# EAGLE design raspi (EAGLE 6.4)
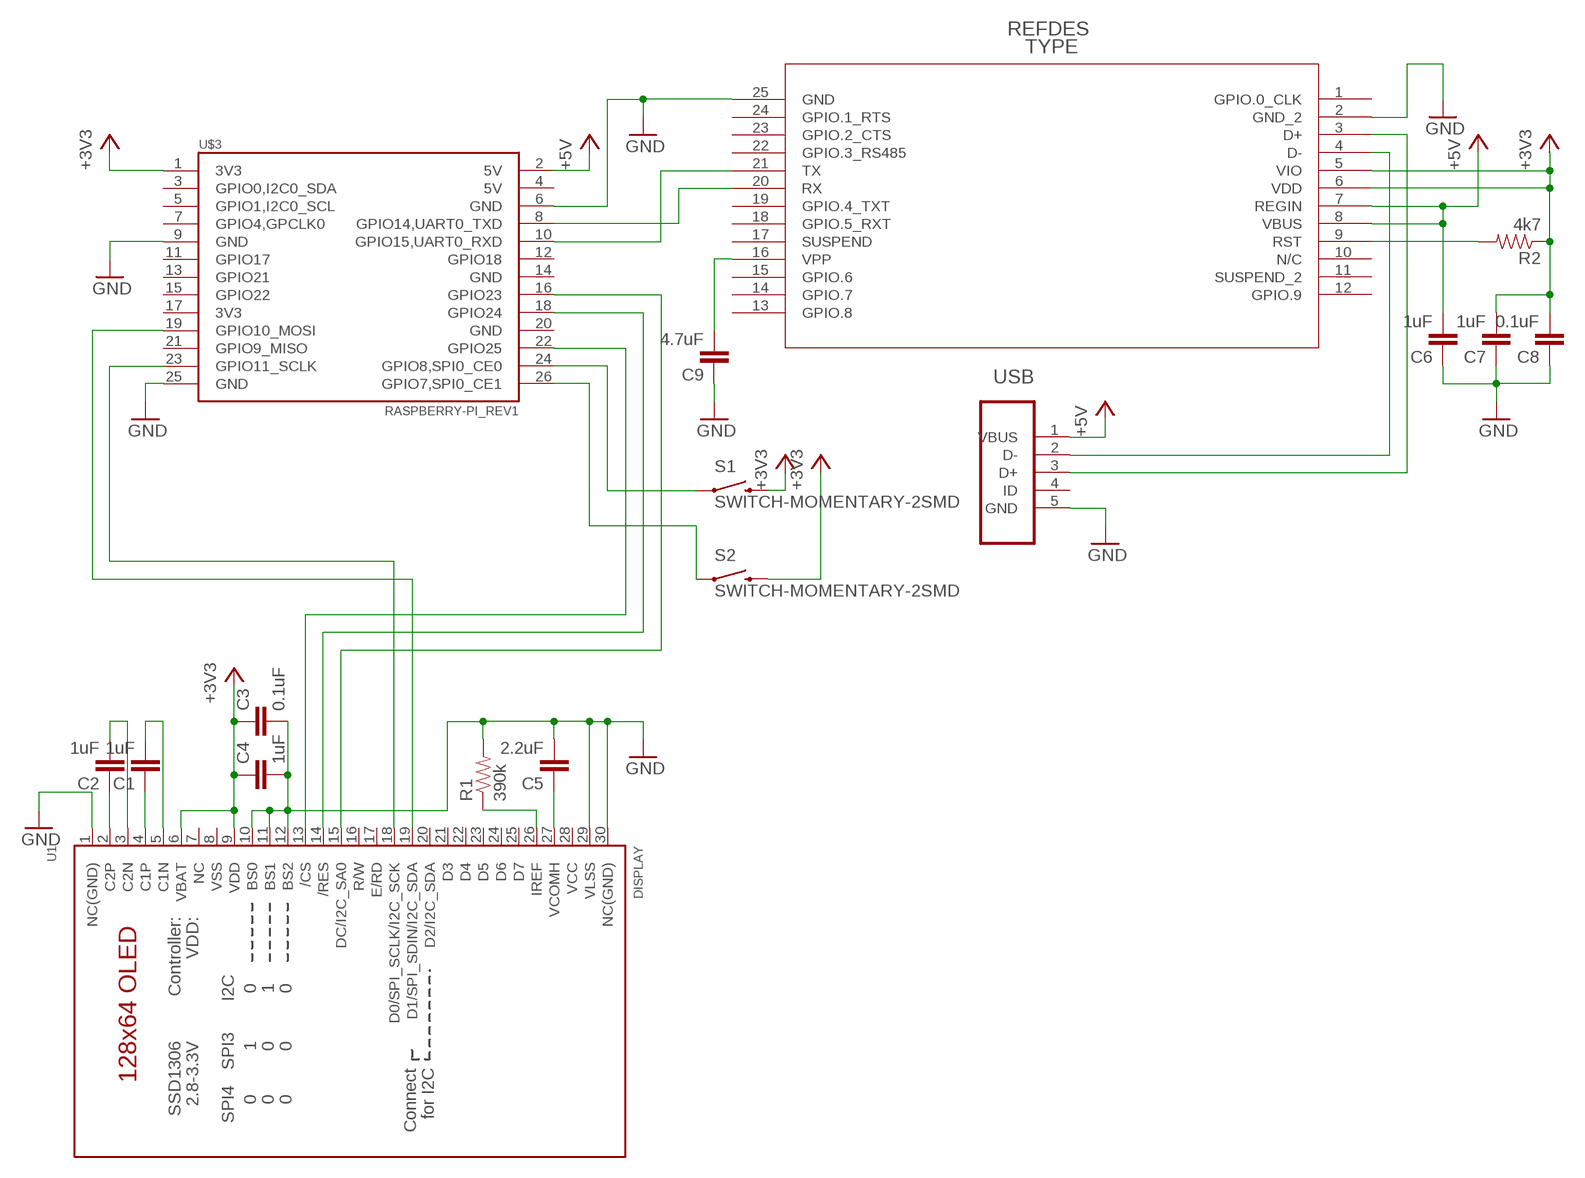
[diagram p0: schematic, sheet 1]

## Parts
C1  1uF  CAP0805  [0805]
C2  1uF  CAP0805  [0805]
C3  0.1uF  CAP0805  [0805]
C4  1uF  CAP0805  [0805]
C5  2.2uF  CAP0805  [0805]
C6  1uF  CAP0805  [0805]
C7  1uF  CAP0805  [0805]
C8  0.1uF  CAP0805  [0805]
C9  4.7uF  CAP0805  [0805]
R1  390k  RESISTOR0805-RES  [0805]
R2  4k7  RESISTOR0805-RES  [0805]
S1  SWITCH-MOMENTARY-2SMD  [TACTILE_SWITCH_SMD]
S2  SWITCH-MOMENTARY-2SMD  [TACTILE_SWITCH_SMD]
U1  DISPLAY  DISP_OLED_UG-2864HSWEG010.96"  [UG-2864HSWEG01_0.96IN_WRAPAROUND]
U2  CP2110-F01-GM  [CP2110-F01-GM]
U$3  RASPBERRY-PI_REV1  [RASPBERRY-PI_REV1]
USB  47346-0001  [MOLEX_47346-0001]

## Nets
+3V3: C3.1 C4.1 C7.2 C8.2 R2.1 S1.3 S2.3 U1.6(VBAT) U1.9(VDD) U2.5(VIO) U2.6(VDD) U$3.1(3V3)
+5V: C6.2 U2.7(REGIN) U2.8(VBUS) U$3.2(5V) USB.1(VBUS)
GND: C3.2 C4.2 C5.2 C6.1 C7.1 C8.1 C9.1 R1.2 U1.1(NC(GND)) U1.10(BS0) U1.11(BS1) U1.12(BS2) U1.29(VLSS) U1.30(NC(GND)) U2.2(GND_2) U2.25(GND) U$3.6(GND) U$3.9(GND) U$3.25(GND) USB.5(GND)
N$1: U1.19(D1/SPI_SDIN/I2C_SDA) U$3.19(GPIO10_MOSI)
N$2: S2.1 U$3.26(GPIO7,SPI0_CE1)
N$3: S1.1 U$3.24(GPIO8,SPI0_CE0)
N$4: U1.15(DC/I2C_SA0) U$3.16(GPIO23)
N$5: U1.18(D0/SPI_SCLK/I2C_SCK) U$3.23(GPIO11_SCLK)
N$6: C5.1 U1.27(VCOMH)
N$7: U1.13(/CS) U$3.22(GPIO25)
N$8: U1.14(/RES) U$3.18(GPIO24)
N$9: R1.1 U1.26(IREF)
N$10: C2.1 U1.2(C2P)
N$11: C1.1 U1.4(C1P)
N$12: C2.2 U1.3(C2N)
N$13: C1.2 U1.5(C1N)
N$14: C9.2 U2.16(VPP)
N$16: U2.21(TX) U$3.10(GPIO15,UART0_RXD)
N$17: U2.20(RX) U$3.8(GPIO14,UART0_TXD)
N$20: R2.2 U2.9(RST)
USB_D_N: U2.4(D-) USB.2(D-)
USB_D_P: U2.3(D+) USB.3(D+)
Unconnected: U1.7(NC) U1.16(R/W) U1.17(E/RD) U1.20(D2/I2C_SDA) U1.21(D3) U1.22(D4) U1.23(D5) U1.24(D6) U1.25(D7) U2.1(GPIO.0_CLK) U2.10(N/C) U2.11(SUSPEND_2) U2.12(GPIO.9) U2.13(GPIO.8) U2.14(GPIO.7) U2.15(GPIO.6) U2.17(SUSPEND) U2.18(GPIO.5_RXT) U2.19(GPIO.4_TXT) U2.22(GPIO.3_RS485) U2.23(GPIO.2_CTS) U2.24(GPIO.1_RTS) U$3.3(GPIO0,I2C0_SDA) U$3.4(5V) U$3.5(GPIO1,I2C0_SCL) U$3.7(GPIO4,GPCLK0) U$3.11(GPIO17) U$3.12(GPIO18) U$3.13(GPIO21) U$3.14(GND) U$3.15(GPIO22) U$3.17(3V3) U$3.20(GND) U$3.21(GPIO9_MISO) USB.4(ID)

## Power pins joined to a net without a drawn wire
GND: U1.8(VSS)
VCC: U1.28(VCC)

## Library data of the parts
C1-C9 = SparkFun-Capacitors:CAP: Capacitor Standard 0603 ceramic capacitor, and 0.1" leaded capacitor.
R1 R2 = SparkFun-Resistors:RESISTOR: Resistor Basic schematic elements and footprints for 0603, 1206, and PTH resistors.
S1 S2 = SparkFun-Electromechanical:SWITCH-MOMENTARY-2: Various NO switches- pushbuttons, reed, etc
U1 = microbuilder:DISP_OLED_UG-2864HSWEG01: UG-2864HSWEG01 OLED display Both 1.3" and 0.96" models share the same FPC tab footprint, only the screen dimensions vary.
U2 = bxl_import:CP2110-F01-GM
U$3 = RaspberryPi:RASPBERRY-PI_REV1: Raspberry Pi Board <http://www.raspberrypi.org/> Jacques Lagnel V1.0 (beta) 2012 Mateusz Bawaj V1.1 (beta) 2012 Board dimension: Forum 3D model <http://www.raspberrypi.org/forum/general-discussion/mechanical-profile-3d-models?value=3d%20model&type=1&include=1&search=1&ret=all> The GPIO Connector (P1): http://elinux.org/RPi_Low-level_peripherals
USB = fabhack:47346-0001: CONN RCPT 5POS MICRO USB R/A SMD; MPN: 47346-0001; OC_FARNELL: 1568026; OC_NEWARK: 47M0505; PACKAGE: 5 POS MICRO USB R/A; SUPPLIER: MOLEX

## Board
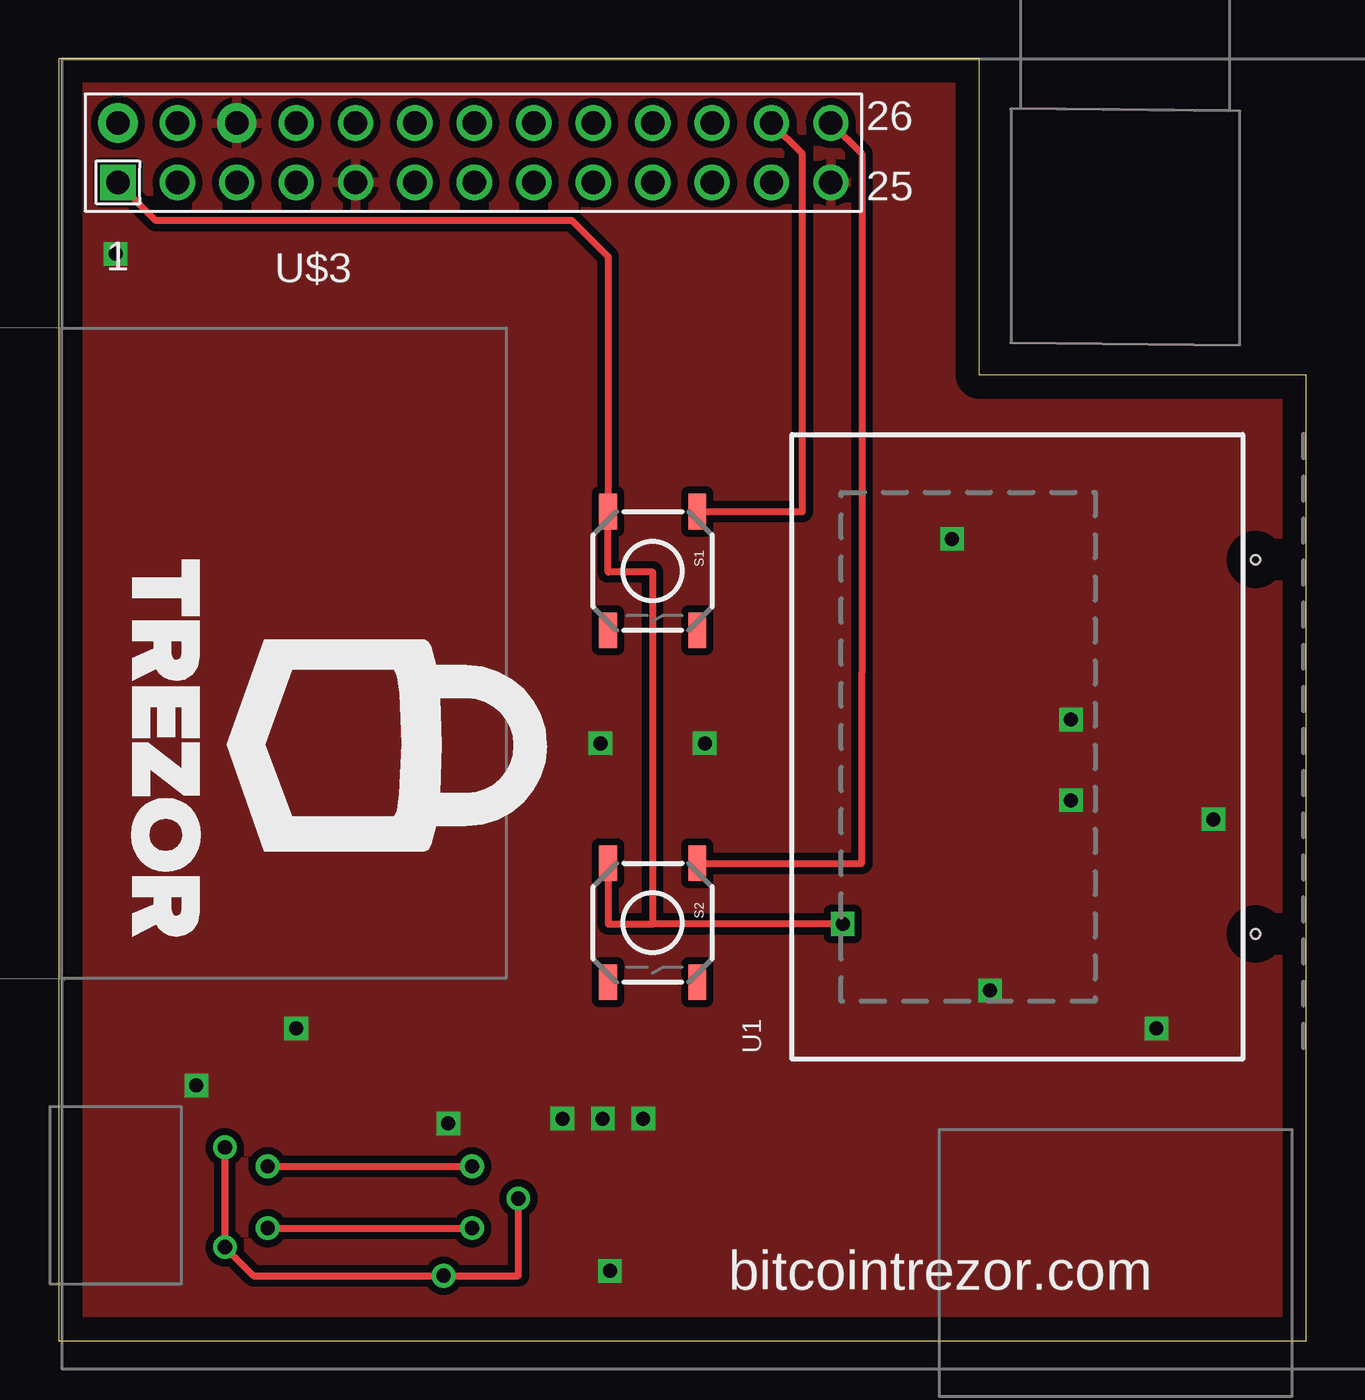
[diagram p1: board, top side]
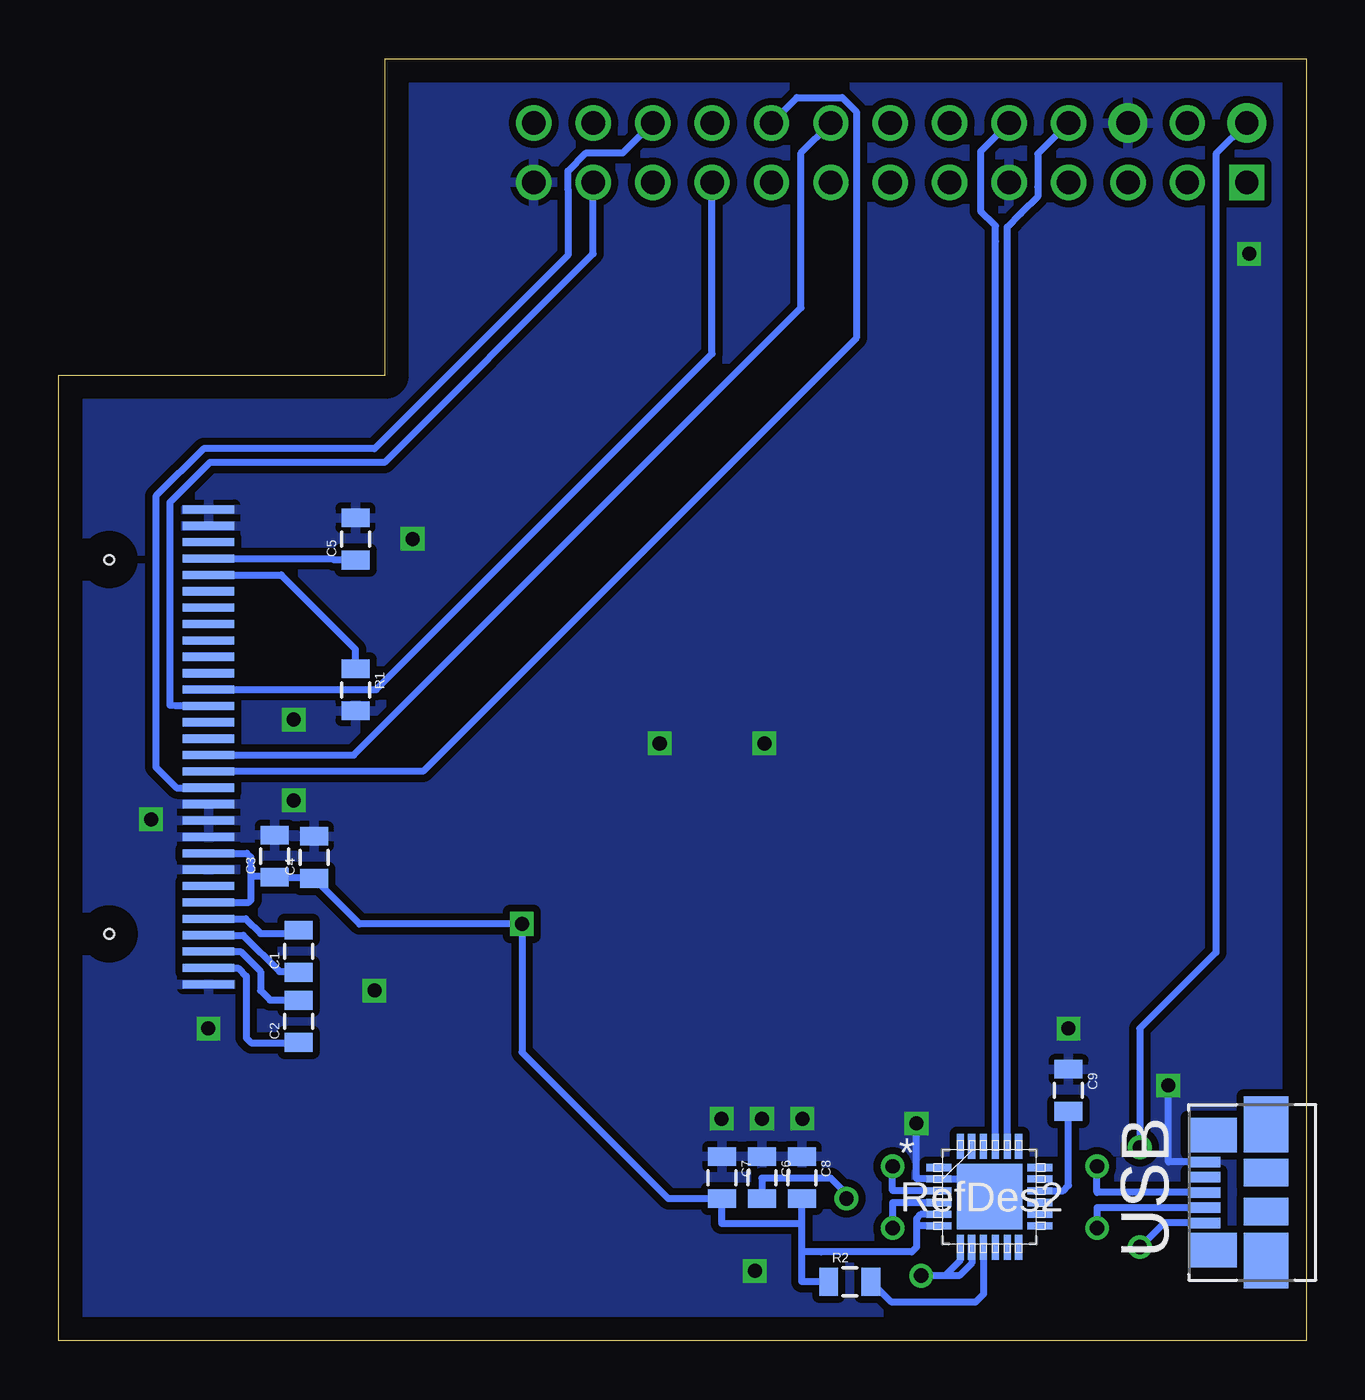
[diagram p2: board, bottom side, seen from below]

Size 53.34 x 54.83 mm. Coordinates in mm from the lower left corner, seen from the top.
Outline: 0,0 53.34,0 53.34,41.3 39.37,41.3 39.37,54.83 0,54.83 0,0
Copper layers (1*16): Top 0.035mm / dielectric 1.5mm / Bottom 0.035mm
Design rules "default *": minimum track width 12mil, minimum drill 24mil, track to track 12mil, track to pad 12mil, pad to pad 12mil, via to via 12mil, smd to smd 8mil, copper to edge 40mil, drill to drill 8mil, minimum pad ring 10mil, minimum via ring 8mil, stop-mask expansion 4mil, vias tented up to drill 0mil, thermal gap 10mil

### Footprints (pad centres in the part's own frame; a part is rotated, then mirrored left to right if it is on the bottom)
0805 = smd 0.8 x 1.2: 1 -0.9,0; 2 0.9,0
TACTILE_SWITCH_SMD = smd 1.524 x 0.762: 1 -2.54,1.905; 2 2.54,1.905; 3 -2.54,-1.905; 4 2.54,-1.905
UG-2864HSWEG01_0.96IN_WRAPAROUND = smd 0.35 x 2.2 bottom: 1 -10.15,-1.2; 2 -9.45,-1.2; 3 -8.75,-1.2; 4 -8.05,-1.2; 5 -7.35,-1.2; 6 -6.65,-1.2; 7 -5.95,-1.2; 8 -5.25,-1.2; 9 -4.55,-1.2; 10 -3.85,-1.2; 11 -3.15,-1.2; 12 -2.45,-1.2; 13 -1.75,-1.2; 14 -1.05,-1.2; 15 -0.35,-1.2; 16 0.35,-1.2; 17 1.05,-1.2; 18 1.75,-1.2; 19 2.45,-1.2; 20 3.15,-1.2; 21 3.85,-1.2; 22 4.55,-1.2; 23 5.25,-1.2; 24 5.95,-1.2; 25 6.65,-1.2; 26 7.35,-1.2; 27 8.05,-1.2; 28 8.75,-1.2; 29 9.45,-1.2; 30 10.15,-1.2 | hole 0.4: -8,-5.45; 8,-5.45
CP2110-F01-GM = smd 1.067 x 0.305: 1 -2.159,1.245; 2 -2.159,0.762; 3 -2.159,0.254; 4 -2.159,-0.254; 5 -2.159,-0.762; 6 -2.159,-1.245; 13 2.159,-1.245; 14 2.159,-0.762; 15 2.159,-0.254; 16 2.159,0.254; 17 2.159,0.762; 18 2.159,1.245 | smd 0.305 x 1.067: 7 -1.245,-2.159; 8 -0.762,-2.159; 9 -0.254,-2.159; 10 0.254,-2.159; 11 0.762,-2.159; 12 1.245,-2.159; 19 1.245,2.159; 20 0.762,2.159; 21 0.254,2.159; 22 -0.254,2.159; 23 -0.762,2.159; 24 -1.245,2.159 | smd 2.794 x 2.794: 25 0,0
RASPBERRY-PI_REV1 = drill 1 square: 1 -41.91,21.59 | drill 1 pad 1.676: 2 -41.91,24.13; 6 -36.83,24.13 | drill 1: 3 -39.37,21.59; 4 -39.37,24.13; 5 -36.83,21.59; 7 -34.29,21.59; 8 -34.29,24.13; 9 -31.75,21.59; 10 -31.75,24.13; 11 -29.21,21.59; 12 -29.21,24.13; 13 -26.67,21.59; 14 -26.67,24.13; 15 -24.13,21.59; 16 -24.13,24.13; 17 -21.59,21.59; 18 -21.59,24.13; 19 -19.05,21.59; 20 -19.05,24.13; 21 -16.51,21.59; 22 -16.51,24.13; 23 -13.97,21.59; 24 -13.97,24.13; 25 -11.43,21.59; 26 -11.43,24.13
MOLEX_47346-0001 = smd 0.45 x 1.38: 1 -1.3,0; 2 -0.65,0; 3 0,0; 4 0.65,0; 5 1.3,0 | smd 1.475 x 2.1: M1 -2.462,-0.36; M2 2.462,-0.36 | smd 2.375 x 1.9: M3 -2.913,-2.66; M6 2.913,-2.66 | smd 1.175 x 1.9: M4 -0.82,-2.66; M5 0.85,-2.66

### Placement (x,y rotation side)
C1  43.08,16.66 90 bottom
C2  43.08,13.67 90 bottom
C3  44.09,20.73 90 bottom
C4  42.42,20.68 90 bottom
C5  40.64,34.29 90 bottom
C6  23.27,6.99 270 bottom
C7  24.97,6.99 270 bottom
C8  21.56,6.99 270 bottom
C9  10.16,10.72 270 bottom
R1  40.64,27.84 270 bottom
R2  19.51,2.54 0 bottom
S1  25.4,32.92 270 top
S2  25.4,17.88 270 top
U1  45.72,25.4 90 top
U2  13.54,6.17 0 bottom
U$3  44.45,27.94 0 top
USB  4.37,6.35 90 bottom

### Tracks (layer width: path | path; a pad name or v marks a point on that pad's centre or on a via)
+3V3  (via drill 0.6)
  Top 0.305: U$3.1 4.17,47.9 21.95,47.9 23.14,46.71 23.5,46.35 S1.3 23.5,32.87 25.4,32.87 25.4,17.83 | v33.53,17.83 25.4,17.83 | S2.3 23.5,17.83 25.4,17.83
  Bottom 0.305: U2.5 16.48,5.41 16.66,5.23 16.66,4.83 | 16.66,4.83 16.66,4.01 16.87,3.81 20.73,3.81 21.57,3.81 | U2.6 16.56,4.93 16.66,4.83 | C7.2 24.99,6.09 | 24.99,6.09 24.99,5.03 21.57,5.03 | 21.57,5.03 C8.2 | R2.1 21.57,2.54 21.57,3.81 | 21.57,3.81 21.57,5.03 | 24.99,6.09 27.27,6.09 29.87,8.69 33.53,12.34 v33.53,17.83 40.47,17.83 C4.1 42.47,19.83 C3.1 44.13,19.86 45.11,19.86 | U1.9 45.28,20.85 45.11,20.68 45.11,19.86 | 45.11,19.86 45.11,18.85 45.21,18.75 U1.6
+5V  (via drill 0.61, 0.61 pad 1.02)
  Top 0.305: v19.66,6.09 19.66,2.79 v16.46,2.79 8.33,2.79 v7.11,4.01 v7.11,8.28
  Bottom 0.305: U2.7 | U2.8 14.3,3.33 14.83,2.79 v16.46,2.79 15.44,2.79 14.78,3.45 U2.7 | v19.66,6.09 19.66,6.3 20.32,6.96 23.27,6.96 C6.2 | U$3.2 3.86,50.75 3.86,16.61 7.11,13.36 v7.11,8.28 | USB.1 6.08,5.05 v7.11,4.01
GND  (via drill 0.6)
  Bottom 0.305: U2.25 14.3,6.93 U2.2 16.66,6.93 v16.66,9.3 | 42.47,21.63 C4.2 | USB.5 5.89,7.65 v5.89,10.92
  other vias: 23.57,3 43.28,26.57 43.28,23.11 49.38,22.3 38.2,34.29 39.83,14.99 21.54,9.5 10.16,13.36 46.94,13.36 2.44,46.48 27.64,25.55 24.99,9.5 23.16,25.55 23.27,9.5
  pour Bottom: -0.81,-2.29 53.85,-2.29 53.85,56.24 -0.81,56.24
  pour Top: -1.22,-2.29 53.85,-2.29 53.85,56.24 -1.22,56.24
N$1
  Bottom 0.305: U1.19 39.75,27.85 25.4,42.2 U$3.19
N$2
  Top 0.305: U$3.26 34.34,50.75 34.34,28.55 34.34,20.42 S2.1
N$3
  Top 0.305: U$3.24 31.8,50.75 31.8,35.46 S1.1
N$4
  Bottom 0.305: U1.15 40.72,25.05 21.59,44.18 21.59,50.8 U$3.16
N$5
  Bottom 0.305: U$3.23 30.48,46.48 39.4,37.56 46.87,37.56 48.56,35.86 48.56,27.18 48.33,27.15 U1.18
N$6
  Bottom 0.305: C5.1 41.57,33.39 41.63,33.45 U1.27
N$7
  Bottom 0.305: U$3.22 29.21,50.8 30.78,50.8 31.56,50.02 31.56,49.23 31.56,46.41 39.83,38.15 47.14,38.15 49.17,36.12 49.17,24.94 49.17,24.54 48.29,23.65 U1.13
N$8
  Bottom 0.305: U$3.18 21.77,53.16 19.83,53.16 19.23,52.56 19.23,42.88 37.76,24.35 U1.14
N$9
  Bottom 0.305: R1.1 40.64,29.57 43.82,32.75 U1.26
N$10
  Bottom 0.305: U1.2 45.67,15.95 45.31,15.6 45.31,12.95 45.11,12.75 43.09,12.75 C2.1
N$11
  Bottom 0.305: U1.4 45.44,17.35 43.89,15.8 43.12,15.8 C1.1
N$12
  Bottom 0.305: U1.3 45.55,16.65 44.7,15.8 44.7,14.99 44.3,14.58 43.09,14.58 C2.2
N$13
  Bottom 0.305: U1.5 45.33,18.05 44.7,17.42 43.22,17.42 C1.2
N$14
  Bottom 0.305: U2.16 10.39,6.43 10.16,6.65 C9.2
N$16
  Bottom 0.305: U2.21 13.28,47.01 13.28,47.68 13.92,48.31 13.92,50.85 U$3.10
N$17
  Bottom 0.305: U2.20 12.78,44.59 12.78,44.88 12.78,47.62 12.19,48.21 11.48,48.92 11.48,49.33 11.48,50.75 U$3.8 | U2.20
N$20
  Bottom 0.305: U2.9 13.79,2.01 14.14,1.66 17.73,1.66 R2.2
USB_D_N  (via drill 0.61 pad 1.02)
  Top 0.305: v8.94,4.83 v17.68,4.83
  Bottom 0.305: U2.4 17.68,5.92 v17.68,4.83 | USB.2 8.94,5.7 v8.94,4.83
USB_D_P  (via drill 0.61 pad 1.02)
  Top 0.305: v8.94,7.47 v17.68,7.47
  Bottom 0.305: U2.3 17.68,6.43 v17.68,7.47 | USB.3 8.94,6.35 v8.94,7.47

### Text on the board
tSilk: bitcointrezor.com